# Altium schematic sheet SoM.SchDoc
size A3
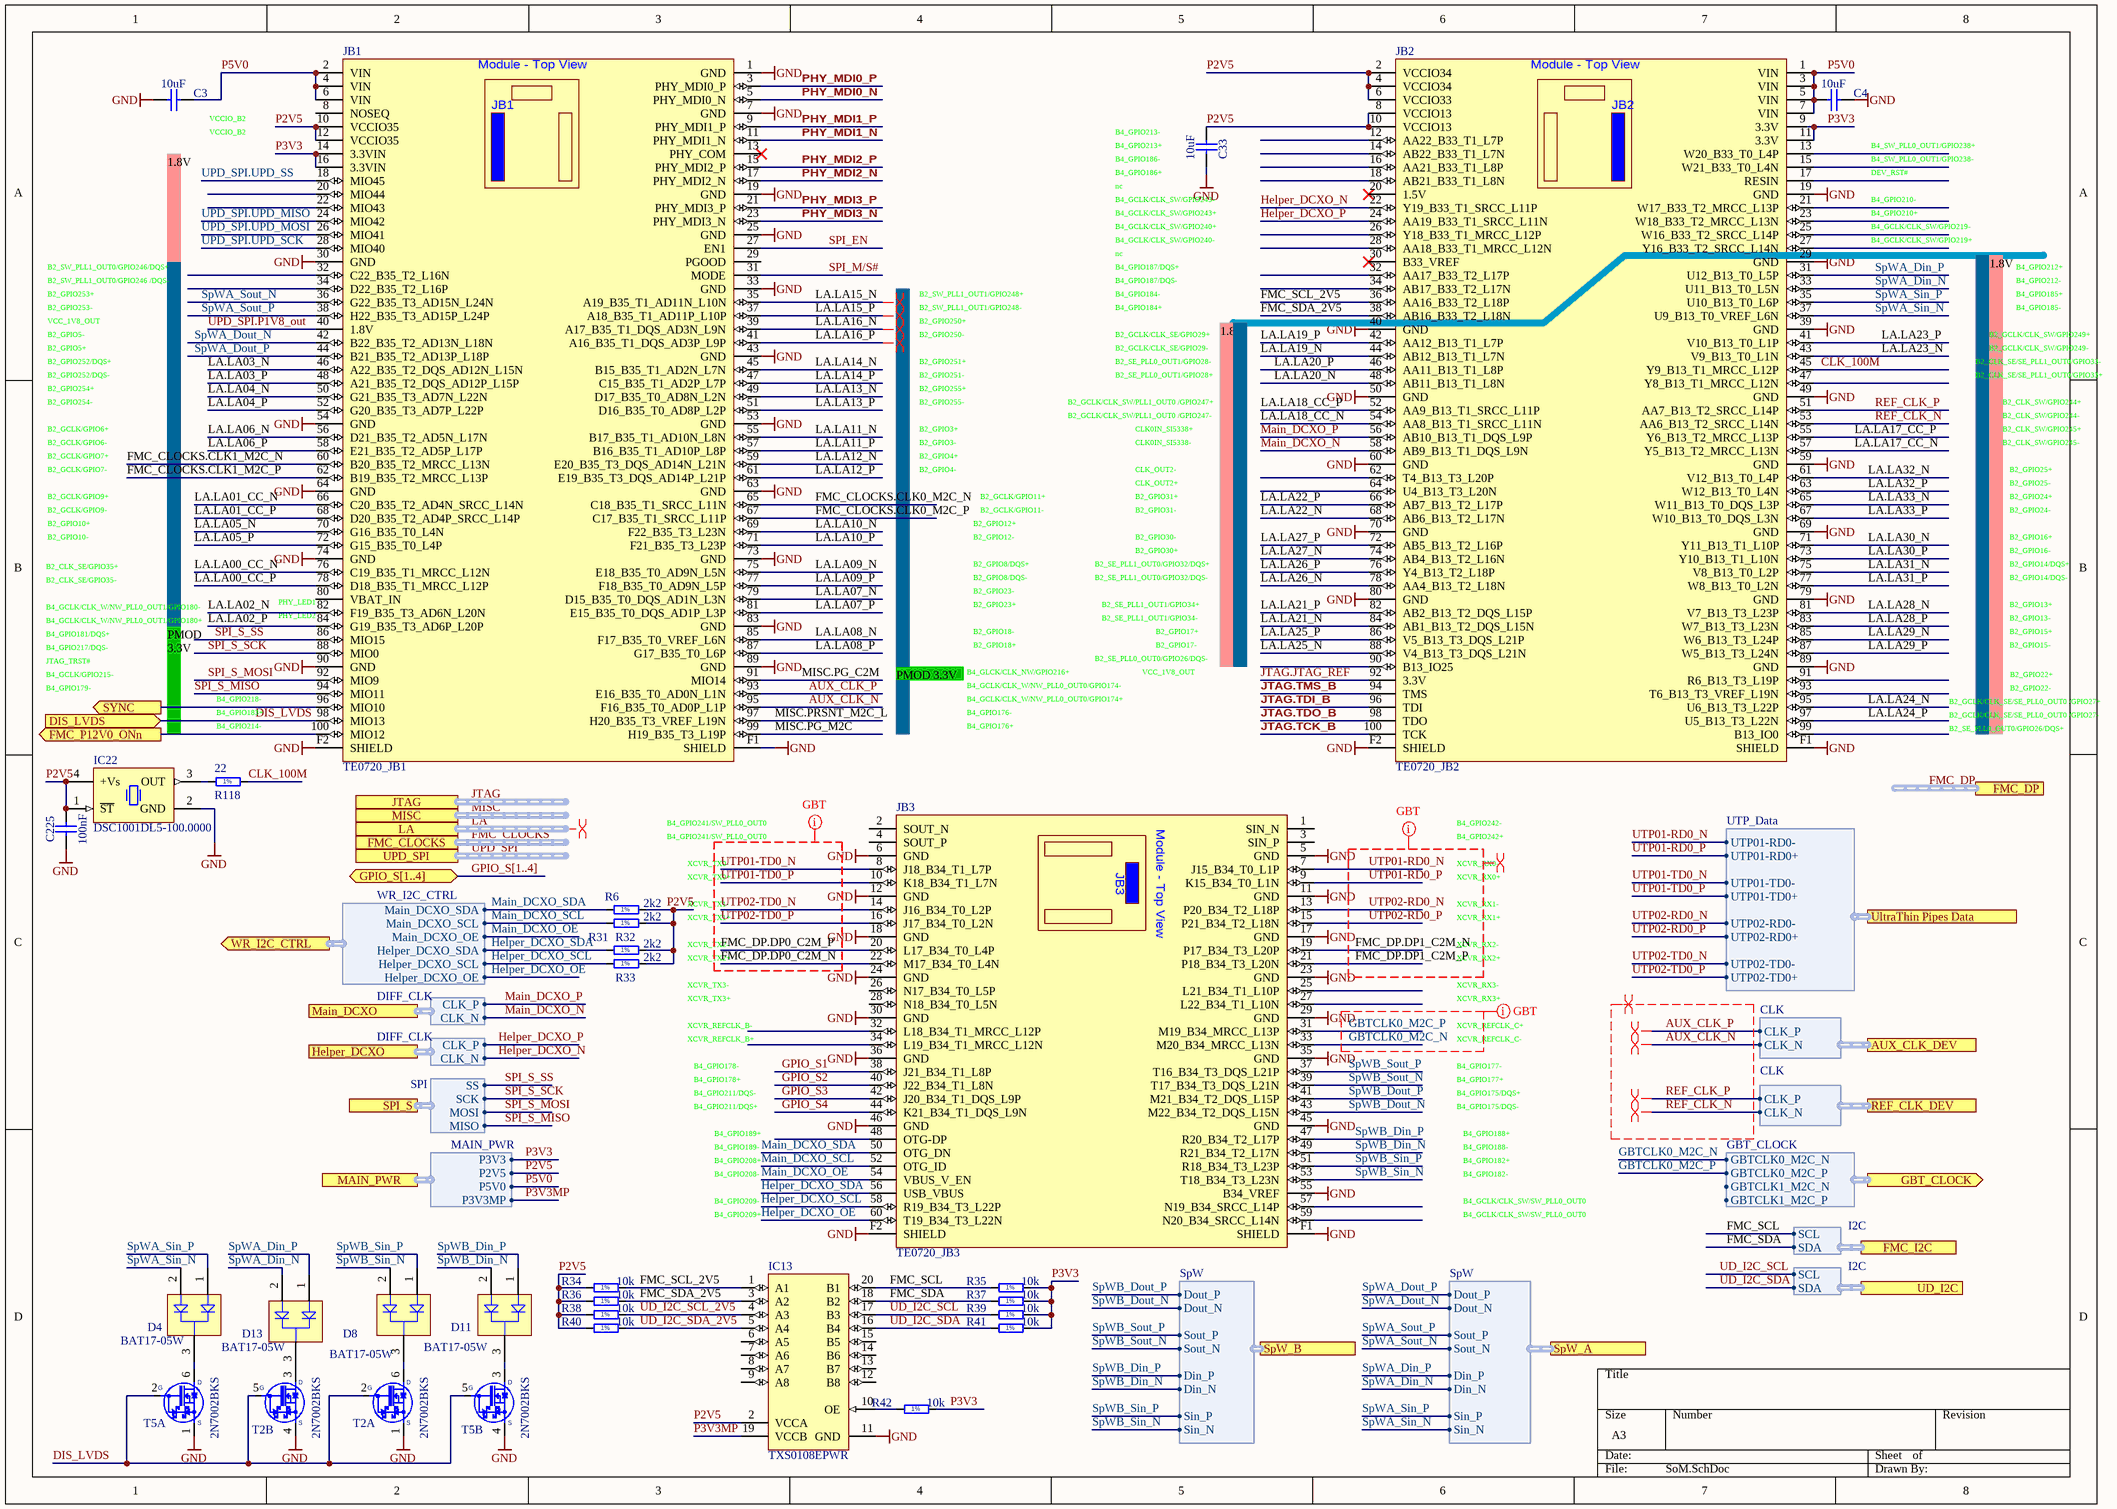
[diagram p0: SoM.SchDoc]

## Parts
C3  10uF  [CAPC2012X95N]
C4  10uF  [CAPC2012X95N]
C33  10uF  [CAPC2012X95N]
C225  100nF  [CAPC0603X33N]
D4  BAT17-05W  [INF-SOT323_N]
D8  BAT17-05W  [INF-SOT323_N]
D11  BAT17-05W  [INF-SOT323_N]
D13  BAT17-05W  [INF-SOT323_N]
IC13  TXS0108EPWR  [PW0020A_M]
IC22  DSC1001DL5-100.0000  [OSC_MICREL_2520]
JB1  TE0720_JB1  [LSHM-150-XXX-X-DV-A-X]
JB2  TE0720_JB2  [LSHM-150-XXX-X-DV-A-X]
JB3  TE0720_JB3  [LSHM-130-04.0-x-DV-A-S-K-TR]
R6  2k2  [RESC1005X40N]
R31  2k2  [RESC1005X40N]
R32  2k2  [RESC1005X40N]
R33  2k2  [RESC1005X40N]
R34  10k  [RESC1005X40N]
R35  10k  [RESC1005X40N]
R36  10k  [RESC1005X40N]
R37  10k  [RESC1005X40N]
R38  10k  [RESC1005X40N]
R39  10k  [RESC1005X40N]
R40  10k  [RESC1005X40N]
R41  10k  [RESC1005X40N]
R42  10k  [RESC1005X40N]
R118  22  [RESC1005X40N]
T2  2N7002BKS  [SOT65P210X110-6N]  (parts A,B of 2)
T5  2N7002BKS  [SOT65P210X110-6N]  (parts A,B of 2)

## Ports
AUX_CLK_DEV (harness CLK), DIS_LVDS (in), FMC_CLOCKS (harness FMC_CLOCKS), FMC_DP (harness FMC_DP), FMC_I2C (harness I2C), FMC_P12V0_ONn (out), GBT_CLOCK (out, harness GBT_CLOCK), GPIO_S[1..4] (bidir), Helper_DCXO (harness DIFF_CLK), JTAG (harness JTAG), LA (harness FMC_J1_LA), Main_DCXO (harness DIFF_CLK), MAIN_PWR (harness MAIN_PWR), MISC (harness MISC), REF_CLK_DEV (harness CLK), SPI_S (harness SPI), SpW_A (harness SpW), SpW_B (harness SpW), SYNC (out), UD_I2C (harness I2C), UltraThin Pipes Data (harness UTP_Data), UPD_SPI (harness UPD_SPI), WR_I2C_CTRL (out, harness WR_I2C_CTRL)

## Harnesses
SpW: Sout_P, Sout_N, Dout_P, Dout_N, Sin_P, Sin_N, Din_P, Din_N
UTP_Data: UTP02-RD0-, UTP02-RD0+, UTP02-TD0-, UTP02-TD0+, UTP01-RD0-, UTP01-RD0+, UTP01-TD0-, UTP01-TD0+
CLK: CLK_P, CLK_N
GBT_CLOCK: GBTCLK0_M2C_N, GBTCLK0_M2C_P, GBTCLK1_M2C_N, GBTCLK1_M2C_P
SPI: MISO, MOSI, SCK, SS
I2C: SCL, SDA
WR_I2C_CTRL: Helper_DCXO_OE, Helper_DCXO_SCL, Helper_DCXO_SDA, Main_DCXO_OE, Main_DCXO_SCL, Main_DCXO_SDA
DIFF_CLK: CLK_N, CLK_P
MAIN_PWR: P3V3, P2V5, P5V0, P3V3MP

## Nets
GND: C3.2 C4.1 C33.2 C225.1 IC13.11(GND) IC22.2(GND) JB1.1(GND) JB1.7(GND) JB1.19(GND) JB1.25(GND) JB1.30(GND) JB1.33(GND) JB1.43(GND) JB1.53(GND) JB1.54(GND) JB1.63(GND) JB1.64(GND) JB1.73(GND) JB1.74(GND) JB1.83(GND) JB1.89(GND) JB1.90(GND) JB1.F1(SHIELD) JB1.F2(SHIELD) JB2.19(GND) JB2.29(GND) JB2.39(GND) JB2.40(GND) JB2.49(GND) JB2.50(GND) JB2.59(GND) JB2.60(GND) JB2.69(GND) JB2.70(GND) JB2.79(GND) JB2.80(GND) JB2.89(GND) JB2.F1(SHIELD) JB2.F2(SHIELD) JB3.5(GND) JB3.6(GND) JB3.11(GND) JB3.12(GND) JB3.17(GND) JB3.18(GND) JB3.23(GND) JB3.24(GND) JB3.29(GND) JB3.30(GND) JB3.35(GND) JB3.36(GND) JB3.45(GND) JB3.46(GND) JB3.55(B34_VREF) JB3.F1(SHIELD) JB3.F2(SHIELD) T2.1(S) T2.4(S) T5.1(S) T5.4(S)
AUX_CLK_N: JB1.95(F16_B35_T0_AD0P_L1P) ; port AUX_CLK_DEV.CLK_N
AUX_CLK_P: JB1.93(E16_B35_T0_AD0N_L1N) ; port AUX_CLK_DEV.CLK_P
CLK_100M: JB2.45(Y9_B13_T1_MRCC_L12P) R118.2
DIS_LVDS: JB1.98(MIO13) T2.2(G) T2.5(G) T5.2(G) T5.5(G) ; port DIS_LVDS
FMC_CLOCKS.CLK0_M2C_N: JB1.65(C18_B35_T1_SRCC_L11N)
FMC_CLOCKS.CLK0_M2C_P: JB1.67(C17_B35_T1_SRCC_L11P)
FMC_CLOCKS.CLK1_M2C_N: JB1.60(B20_B35_T2_MRCC_L13N)
FMC_CLOCKS.CLK1_M2C_P: JB1.62(B19_B35_T2_MRCC_L13P)
FMC_DP.DP0_C2M_N: JB3.22(M17_B34_T0_L4N)
FMC_DP.DP0_C2M_P: JB3.20(L17_B34_T0_L4P)
FMC_DP.DP1_C2M_N: JB3.19(P17_B34_T3_L20P)
FMC_DP.DP1_C2M_P: JB3.21(P18_B34_T3_L20N)
FMC_P12V0_ONn: JB1.100(MIO12) ; port FMC_P12V0_ONn
FMC_SCL: IC13.20(B1) R35.1 ; port FMC_I2C.SCL
FMC_SCL_2V5: IC13.1(A1) JB2.36(AA16_B33_T2_L18P) R34.2
FMC_SDA: IC13.18(B2) R37.1 ; port FMC_I2C.SDA
FMC_SDA_2V5: IC13.3(A2) JB2.38(AB16_B33_T2_L18N) R36.2
GBTCLK0_M2C_N: JB3.33(M20_B34_MRCC_L13N) ; port GBT_CLOCK.GBTCLK0_M2C_N
GBTCLK0_M2C_P: JB3.31(M19_B34_MRCC_L13P) ; port GBT_CLOCK.GBTCLK0_M2C_P
GPIO_S1: JB3.38(J21_B34_T1_L8P)
GPIO_S2: JB3.40(J22_B34_T1_L8N)
GPIO_S3: JB3.42(J20_B34_T1_DQS_L9P)
GPIO_S4: JB3.44(K21_B34_T1_DQS_L9N)
Helper_DCXO_N: JB2.22(Y19_B33_T1_SRCC_L11P) ; port Helper_DCXO.CLK_N
Helper_DCXO_OE: JB3.60(T19_B34_T3_L22N) ; port WR_I2C_CTRL.Helper_DCXO_OE
Helper_DCXO_P: JB2.24(AA19_B33_T1_SRCC_L11N) ; port Helper_DCXO.CLK_P
Helper_DCXO_SCL: JB3.58(R19_B34_T3_L22P) R33.1 ; port WR_I2C_CTRL.Helper_DCXO_SCL
Helper_DCXO_SDA: JB3.56(USB_VBUS) R31.1 ; port WR_I2C_CTRL.Helper_DCXO_SDA
JTAG.JTAG_REF: JB2.92(3.3V)
JTAG.TCK_B: JB2.100(TCK)
JTAG.TDI_B: JB2.96(TDI)
JTAG.TDO_B: JB2.98(TDO)
JTAG.TMS_B: JB2.94(TMS)
LA.LA00_CC_N: JB1.76(C19_B35_T1_MRCC_L12N)
LA.LA00_CC_P: JB1.78(D18_B35_T1_MRCC_L12P)
LA.LA01_CC_N: JB1.66(C20_B35_T2_AD4N_SRCC_L14N)
LA.LA01_CC_P: JB1.68(D20_B35_T2_AD4P_SRCC_L14P)
LA.LA02_N: JB1.82(F19_B35_T3_AD6N_L20N)
LA.LA02_P: JB1.84(G19_B35_T3_AD6P_L20P)
LA.LA03_N: JB1.46(A22_B35_T2_DQS_AD12N_L15N)
LA.LA03_P: JB1.48(A21_B35_T2_DQS_AD12P_L15P)
LA.LA04_N: JB1.50(G21_B35_T3_AD7N_L22N)
LA.LA04_P: JB1.52(G20_B35_T3_AD7P_L22P)
LA.LA05_N: JB1.70(G16_B35_T0_L4N)
LA.LA05_P: JB1.72(G15_B35_T0_L4P)
LA.LA06_N: JB1.56(D21_B35_T2_AD5N_L17N)
LA.LA06_P: JB1.58(E21_B35_T2_AD5P_L17P)
LA.LA07_N: JB1.79(D15_B35_T0_DQS_AD1N_L3N)
LA.LA07_P: JB1.81(E15_B35_T0_DQS_AD1P_L3P)
LA.LA08_N: JB1.85(F17_B35_T0_VREF_L6N)
LA.LA08_P: JB1.87(G17_B35_T0_L6P)
LA.LA09_N: JB1.75(E18_B35_T0_AD9N_L5N)
LA.LA09_P: JB1.77(F18_B35_T0_AD9N_L5P)
LA.LA10_N: JB1.69(F22_B35_T3_L23N)
LA.LA10_P: JB1.71(F21_B35_T3_L23P)
LA.LA11_N: JB1.55(B17_B35_T1_AD10N_L8N)
LA.LA11_P: JB1.57(B16_B35_T1_AD10P_L8P)
LA.LA12_N: JB1.59(E20_B35_T3_DQS_AD14N_L21N)
LA.LA12_P: JB1.61(E19_B35_T3_DQS_AD14P_L21P)
LA.LA13_N: JB1.49(D17_B35_T0_AD8N_L2N)
LA.LA13_P: JB1.51(D16_B35_T0_AD8P_L2P)
LA.LA14_N: JB1.45(B15_B35_T1_AD2N_L7N)
LA.LA14_P: JB1.47(C15_B35_T1_AD2P_L7P)
LA.LA15_N: JB1.35(A19_B35_T1_AD11N_L10N)
LA.LA15_P: JB1.37(A18_B35_T1_AD11P_L10P)
LA.LA16_N: JB1.39(A17_B35_T1_DQS_AD3N_L9N)
LA.LA16_P: JB1.41(A16_B35_T1_DQS_AD3P_L9P)
LA.LA17_CC_N: JB2.57(Y5_B13_T2_MRCC_L13N)
LA.LA17_CC_P: JB2.55(Y6_B13_T2_MRCC_L13P)
LA.LA18_CC_N: JB2.54(AA8_B13_T1_SRCC_L11N)
LA.LA18_CC_P: JB2.52(AA9_B13_T1_SRCC_L11P)
LA.LA19_N: JB2.44(AB12_B13_T1_L7N)
LA.LA19_P: JB2.42(AA12_B13_T1_L7P)
LA.LA20_N: JB2.48(AB11_B13_T1_L8N)
LA.LA20_P: JB2.46(AA11_B13_T1_L8P)
LA.LA21_N: JB2.84(AB1_B13_T2_DQS_L15N)
LA.LA21_P: JB2.82(AB2_B13_T2_DQS_L15P)
LA.LA22_N: JB2.68(AB6_B13_T2_L17N)
LA.LA22_P: JB2.66(AB7_B13_T2_L17P)
LA.LA23_N: JB2.43(V9_B13_T0_L1N)
LA.LA23_P: JB2.41(V10_B13_T0_L1P)
LA.LA24_N: JB2.95(U6_B13_T3_L22P)
LA.LA24_P: JB2.97(U5_B13_T3_L22N)
LA.LA25_N: JB2.88(V4_B13_T3_DQS_L21N)
LA.LA25_P: JB2.86(V5_B13_T3_DQS_L21P)
LA.LA26_N: JB2.78(AA4_B13_T2_L18N)
LA.LA26_P: JB2.76(Y4_B13_T2_L18P)
LA.LA27_N: JB2.74(AB4_B13_T2_L16N)
LA.LA27_P: JB2.72(AB5_B13_T2_L16P)
LA.LA28_N: JB2.81(V7_B13_T3_L23P)
LA.LA28_P: JB2.83(W7_B13_T3_L23N)
LA.LA29_N: JB2.85(W6_B13_T3_L24P)
LA.LA29_P: JB2.87(W5_B13_T3_L24N)
LA.LA30_N: JB2.71(Y11_B13_T1_L10P)
LA.LA30_P: JB2.73(Y10_B13_T1_L10N)
LA.LA31_N: JB2.75(V8_B13_T0_L2P)
LA.LA31_P: JB2.77(W8_B13_T0_L2N)
LA.LA32_N: JB2.61(V12_B13_T0_L4P)
LA.LA32_P: JB2.63(W12_B13_T0_L4N)
LA.LA33_N: JB2.65(W11_B13_T0_DQS_L3P)
LA.LA33_P: JB2.67(W10_B13_T0_DQS_L3N)
Main_DCXO_N: JB2.58(AB9_B13_T1_DQS_L9N) ; port Main_DCXO.CLK_N
Main_DCXO_OE: JB3.54(VBUS_V_EN) ; port WR_I2C_CTRL.Main_DCXO_OE
Main_DCXO_P: JB2.56(AB10_B13_T1_DQS_L9P) ; port Main_DCXO.CLK_P
Main_DCXO_SCL: JB3.52(OTG_ID) R32.1 ; port WR_I2C_CTRL.Main_DCXO_SCL
Main_DCXO_SDA: JB3.50(OTG_DN) R6.1 ; port WR_I2C_CTRL.Main_DCXO_SDA
MISC.PG_C2M: JB1.91(MIO14)
MISC.PG_M2C: JB1.99(H19_B35_T3_L19P)
MISC.PRSNT_M2C_L: JB1.97(H20_B35_T3_VREF_L19N)
P2V5: C33.1 C225.2 IC13.2(VCCA) IC22.1(~{ST}) IC22.4(+Vs) JB1.10(VCCIO35) JB1.12(VCCIO35) JB2.2(VCCIO34) JB2.4(VCCIO34) JB2.6(VCCIO33) JB2.8(VCCIO13) JB2.10(VCCIO13) R6.2 R31.2 R32.2 R33.2 R34.1 R36.1 R38.1 R40.1 ; port MAIN_PWR.P2V5  [also labelled XCVR_TX1-]
P3V3: JB1.14(3.3VIN) JB1.16(3.3VIN) JB2.9(3.3V) JB2.11(3.3V) R35.2 R37.2 R39.2 R41.2 R42.2 ; port MAIN_PWR.P3V3
P3V3MP: IC13.19(VCCB) ; port MAIN_PWR.P3V3MP
P5V0: C3.1 C4.2 JB1.2(VIN) JB1.4(VIN) JB1.6(VIN) JB2.1(VIN) JB2.3(VIN) JB2.5(VIN) JB2.7(VIN) ; port MAIN_PWR.P5V0
PHY_MDI0_N: JB1.5(PHY_MDI0_N)
PHY_MDI0_P: JB1.3(PHY_MDI0_P)
PHY_MDI1_N: JB1.11(PHY_MDI1_N)
PHY_MDI1_P: JB1.9(PHY_MDI1_P)
PHY_MDI2_N: JB1.17(PHY_MDI2_N)
PHY_MDI2_P: JB1.15(PHY_MDI2_P)
PHY_MDI3_N: JB1.23(PHY_MDI3_N)
PHY_MDI3_P: JB1.21(PHY_MDI3_P)
REF_CLK_N: JB2.53(AA6_B13_T2_SRCC_L14N) ; port REF_CLK_DEV.CLK_N
REF_CLK_P: JB2.51(AA7_B13_T2_SRCC_L14P) ; port REF_CLK_DEV.CLK_P
SPI_EN: JB1.27(EN1)
SPI_M/S#: JB1.31(MODE)
SPI_S_MISO: JB1.94(MIO11) ; port SPI_S.MISO
SPI_S_MOSI: JB1.92(MIO9) ; port SPI_S.MOSI
SPI_S_SCK: JB1.88(MIO0) ; port SPI_S.SCK
SPI_S_SS: JB1.86(MIO15) ; port SPI_S.SS
SpWA_Din_N: D13.2(A2) JB2.33(U11_B13_T0_L5N) ; port SpW_A.Din_N
SpWA_Din_P: D13.1(A1) JB2.31(U12_B13_T0_L5P) ; port SpW_A.Din_P
SpWA_Dout_N: JB1.42(B22_B35_T2_AD13N_L18N) ; port SpW_A.Dout_N
SpWA_Dout_P: JB1.44(B21_B35_T2_AD13P_L18P) ; port SpW_A.Dout_P
SpWA_Sin_N: D4.2(A2) JB2.37(U9_B13_T0_VREF_L6N) ; port SpW_A.Sin_N
SpWA_Sin_P: D4.1(A1) JB2.35(U10_B13_T0_L6P) ; port SpW_A.Sin_P
SpWA_Sout_N: JB1.36(G22_B35_T3_AD15N_L24N) ; port SpW_A.Sout_N
SpWA_Sout_P: JB1.38(H22_B35_T3_AD15P_L24P) ; port SpW_A.Sout_P
SpWB_Din_N: D11.2(A2) JB3.49(R21_B34_T2_L17N) ; port SpW_B.Din_N
SpWB_Din_P: D11.1(A1) JB3.47(R20_B34_T2_L17P) ; port SpW_B.Din_P
SpWB_Dout_N: JB3.43(M22_B34_T2_DQS_L15N) ; port SpW_B.Dout_N
SpWB_Dout_P: JB3.41(M21_B34_T2_DQS_L15P) ; port SpW_B.Dout_P
SpWB_Sin_N: D8.2(A2) JB3.53(T18_B34_T3_L23N) ; port SpW_B.Sin_N
SpWB_Sin_P: D8.1(A1) JB3.51(R18_B34_T3_L23P) ; port SpW_B.Sin_P
SpWB_Sout_N: JB3.39(T17_B34_T3_DQS_L21N) ; port SpW_B.Sout_N
SpWB_Sout_P: JB3.37(T16_B34_T3_DQS_L21P) ; port SpW_B.Sout_P
SYNC: JB1.96(MIO10) ; port SYNC
UD_I2C_SCL: IC13.17(B3) R39.1 ; port UD_I2C.SCL
UD_I2C_SCL_2V5: IC13.4(A3) R38.2
UD_I2C_SDA: IC13.16(B4) R41.1 ; port UD_I2C.SDA
UD_I2C_SDA_2V5: IC13.5(A4) R40.2
UPD_SPI.P1V8_out: JB1.40(1.8V)
UPD_SPI.UPD_MISO: JB1.24(MIO42)
UPD_SPI.UPD_MOSI: JB1.26(MIO41)
UPD_SPI.UPD_SCK: JB1.28(MIO40)
UPD_SPI.UPD_SS: JB1.18(MIO45)
UTP01-RD0_N: JB3.7(J15_B34_T0_L1P) ; port UltraThin Pipes Data.UTP01-RD0-
UTP01-RD0_P: JB3.9(K15_B34_T0_L1N) ; port UltraThin Pipes Data.UTP01-RD0+
UTP01-TD0_N: JB3.8(J18_B34_T1_L7P) ; port UltraThin Pipes Data.UTP01-TD0-
UTP01-TD0_P: JB3.10(K18_B34_T1_L7N) ; port UltraThin Pipes Data.UTP01-TD0+
UTP02-RD0_N: JB3.13(P20_B34_T2_L18P) ; port UltraThin Pipes Data.UTP02-RD0-
UTP02-RD0_P: JB3.15(P21_B34_T2_L18N) ; port UltraThin Pipes Data.UTP02-RD0+
UTP02-TD0_N: JB3.14(J16_B34_T0_L2P) ; port UltraThin Pipes Data.UTP02-TD0-
UTP02-TD0_P: JB3.16(J17_B34_T0_L2N) ; port UltraThin Pipes Data.UTP02-TD0+
NetD4_3: D4.3(K) T5.6(D)
NetD8_3: D8.3(K) T2.6(D)
NetD11_3: D11.3(K) T5.3(D)
NetD13_3: D13.3(K) T2.3(D)
NetIC13_10: IC13.10(OE) R42.1
NetIC22_3: IC22.3(OUT) R118.1

Not connected (* = marked no-connect by the designer): IC13 6(A5) 7(A6) 8(A7) 9(A8) 12(B8) 13(B7) 14(B6) 15(B5); JB1 8(NOSEQ) 13(PHY_COM)* 20(MIO44) 22(MIO43) 29(PGOOD) 32(C22_B35_T2_L16N) 34(D22_B35_T2_L16P) 80(VBAT_IN); JB2 12(AA22_B33_T1_L7P) 13(W20_B33_T0_L4P) 14(AB22_B33_T1_L7N) 15(W21_B33_T0_L4N) 16(AA21_B33_T1_L8P) 17(RESIN) 18(AB21_B33_T1_L8N) 20(1.5V)* 21(W17_B33_T2_MRCC_L13P) 23(W18_B33_T2_MRCC_L13N) 25(W16_B33_T2_SRCC_L14P) 26(Y18_B33_T1_MRCC_L12P) 27(Y16_B33_T2_SRCC_L14N) 28(AA18_B33_T1_MRCC_L12N) 30(B33_VREF)* 32(AA17_B33_T2_L17P) 34(AB17_B33_T2_L17N) 47(Y8_B13_T1_MRCC_L12N) 62(T4_B13_T3_L20P) 64(U4_B13_T3_L20N) 90(B13_IO25) 91(R6_B13_T3_L19P) 93(T6_B13_T3_VREF_L19N) 99(B13_IO0); JB3 1(SIN_N) 2(SOUT_N) 3(SIN_P) 4(SOUT_P) 25(L21_B34_T1_L10P) 26(N17_B34_T0_L5P) 27(L22_B34_T1_L10N) 28(N18_B34_T0_L5N) 32(L18_B34_T1_MRCC_L12P) 34(L19_B34_T1_MRCC_L12N) 48(OTG-DP) 57(N19_B34_SRCC_L14P) 59(N20_B34_SRCC_L14N)

## Buses and harness runs
bus GPIO_S[1..4] = port GPIO_S[1..4]
harness FMC_CLOCKS = port FMC_CLOCKS
harness FMC_DP = port FMC_DP
harness JTAG = port JTAG
harness LA = port LA
harness MISC = port MISC
harness UPD_SPI = port UPD_SPI

## Layout directives
differential pair: (no net found under the mark), AUX_CLK_N, AUX_CLK_P, FMC_DP.DP1_C2M_N, FMC_DP.DP1_C2M_P, LA.LA15_N, LA.LA15_P, LA.LA16_N, LA.LA16_P, REF_CLK_N, REF_CLK_P, UTP01-RD0_N, UTP01-RD0_P, UTP02-RD0_N, UTP02-RD0_P, XCVR_RX0+, XCVR_RX0-, XCVR_RX1+, XCVR_RX1-, XCVR_RX2+, XCVR_RX2-
net class GBT; rule Differential Pairs Routing [Pref Gap = 4.33mil    Min Gap  = 4.291mil    Max Gap  = 5milPref Width = 3.385mil    Min Width  = 3.385mil    Max Width  = 7.086mil]: FMC_DP.DP0_C2M_N, FMC_DP.DP0_C2M_P, FMC_DP.DP1_C2M_N, FMC_DP.DP1_C2M_P, GBTCLK0_M2C_N, GBTCLK0_M2C_P, UTP01-RD0_N, UTP01-RD0_P, UTP01-TD0_N, UTP01-TD0_P, UTP02-RD0_N, UTP02-RD0_P, UTP02-TD0_N, UTP02-TD0_P, XCVR_REFCLK_C+, XCVR_REFCLK_C-, XCVR_RX0+, XCVR_RX0-, XCVR_RX1+, XCVR_RX1-, XCVR_RX2+, XCVR_RX2-

## Notes on the sheet
- (near C3) VCCIO_B2
- (near C33) B4_GPIO213-
- (near C33) B4_GPIO213+
- (near C33) B4_GPIO186-
- B4_GPIO186+
- (near C4) B4_SW_PLL0_OUT1/GPIO238+
- B4_SW_PLL0_OUT1/GPIO238-
- DEV_RST#
- nc
- (near C33) B4_GCLK/CLK_SW/GPIO243-
- B4_GCLK/CLK_SW/GPIO243+
- B4_GCLK/CLK_SW/GPIO240+
- B4_GCLK/CLK_SW/GPIO240-
- B4_GPIO210-
- B4_GPIO210+
- B4_GCLK/CLK_SW/GPIO219-
- B4_GCLK/CLK_SW/GPIO219+
- B2_SW_PLL1_OUT0/GPIO246/DQS+
- B2_SW_PLL1_OUT0/GPIO246 /DQS-
- B2_GPIO253+
- B2_GPIO253-
- 1.8V
- B2_SW_PLL1_OUT1/GPIO248+
- B2_SW_PLL1_OUT1/GPIO248-
- B4_GPIO187/DQS+
- B4_GPIO187/DQS-
- B4_GPIO184-
- B4_GPIO184+
- B4_GPIO212+
- B4_GPIO212-
- B4_GPIO185+
- B4_GPIO185-
- VCC_1V8_OUT
- B2_GPIO5-
- B2_GPIO5+
- B2_GPIO252/DQS+
- B2_GPIO252/DQS-
- B2_GPIO250+
- B2_GPIO250-
- B2_GPIO251+
- B2_GPIO251-
- B2_GCLK/CLK_SE/GPIO29+
- B2_GCLK/CLK_SE/GPIO29-
- B2_SE_PLL0_OUT1/GPIO28-
- B2_SE_PLL0_OUT1/GPIO28+
- B2_CLK_SE/SE_PLL1_OUT0/GPIO33-
- B2_CLK_SE/SE_PLL1_OUT0/GPIO33+
- B2_GCLK/CLK_SW/GPIO249+
- B2_GCLK/CLK_SW/GPIO249-
- B2_GPIO254+
- B2_GPIO254-
- B2_GCLK/GPIO6+
- B2_GCLK/GPIO6-
- B2_GPIO255+
- B2_GPIO255-
- B2_GPIO3+
- B2_GPIO3-
- B2_GCLK/CLK_SW/PLL1_OUT0	/GPIO247+
- B2_GCLK/CLK_SW/PLL1_OUT0	/GPIO247-
- CLK0IN_SI5338+
- CLK0IN_SI5338-
- B2_CLK_SW/GPIO244+
- B2_CLK_SW/GPIO244-
- B2_CLK_SW/GPIO245+
- B2_CLK_SW/GPIO245-
- B2_GCLK/GPIO7+
- B2_GCLK/GPIO7-
- B2_GCLK/GPIO9+
- B2_GCLK/GPIO9-
- B2_GPIO4+
- B2_GPIO4-
- B2_GCLK/GPIO11+
- B2_GCLK/GPIO11-
- CLK_OUT2-
- CLK_OUT2+
- B2_GPIO31+
- B2_GPIO31-
- B2_GPIO25+
- B2_GPIO25-
- B2_GPIO24+
- B2_GPIO24-
- B2_CLK_SE/GPIO35+
- B2_CLK_SE/GPIO35-
- B2_GPIO10+
- B2_GPIO10-
- B2_GPIO12+
- B2_GPIO12-
- B2_GPIO8/DQS+
- B2_GPIO8/DQS-
- B2_SE_PLL1_OUT0/GPIO32/DQS+
- B2_SE_PLL1_OUT0/GPIO32/DQS-
- B2_GPIO30-
- B2_GPIO30+
- B2_GPIO16+
- B2_GPIO16-
- B2_GPIO14/DQS+
- B2_GPIO14/DQS-
- B4_GCLK/CLK_W/NW_PLL0_OUT1/GPIO180-
- B4_GCLK/CLK_W/NW_PLL0_OUT1/GPIO180+
- B4_GPIO181/DQS+
- B4_GPIO217/DQS-
- (near JB1) PHY_LED1
- (near JB1) PHY_LED2
- B2_GPIO23-
- B2_GPIO23+
- B2_GPIO18-
- B2_GPIO18+
- B2_SE_PLL1_OUT1/GPIO34+
- B2_SE_PLL1_OUT1/GPIO34-
- B2_GPIO17+
- B2_GPIO17-
- B2_GPIO13+
- B2_GPIO13-
- B2_GPIO15+
- B2_GPIO15-
- JTAG_TRST#
- B4_GCLK/GPIO215-
- B4_GPIO179-
- B4_GPIO218-
- B4_GPIO183+
- PMOD 3.3V
- B4_GLCK/CLK_NW/GPIO216+
- B4_GCLK/CLK_W/NW_PLL0_OUT0/GPIO174-
- B4_GCLK/CLK_W/NW_PLL0_OUT0/GPIO174+
- B4_GPIO176-
- B2_SE_PLL0_OUT0/GPIO26/DQS-
- B2_GCLK/CLK_SE/SE_PLL0_OUT0	/GPIO27+
- B2_GCLK/CLK_SE/SE_PLL0_OUT0	/GPIO27-
- B2_GPIO22+
- B2_GPIO22-
- B4_GPIO214-
- B4_GPIO176+
- B2_SE_PLL0_OUT0/GPIO26/DQS+
- B4_GCLK/CLK_SW/SW_PLL0_OUT0
- Labels drawn without touching a wire or pin: B4_GCLK/CLK_SW/SW_PLL0_OUT0, B4_GPIO175/DQS+, B4_GPIO175/DQS-, B4_GPIO177+, B4_GPIO177-, B4_GPIO178+, B4_GPIO178-, B4_GPIO182+, B4_GPIO182-, B4_GPIO188+, B4_GPIO188-, B4_GPIO189+, B4_GPIO189-, B4_GPIO208+, B4_GPIO208-, B4_GPIO209+, B4_GPIO209-, B4_GPIO211/DQS+, B4_GPIO211/DQS-, B4_GPIO241/SW_PLL0_OUT0, B4_GPIO242+, B4_GPIO242-, XCVR_REFCLK_B+, XCVR_REFCLK_B-, XCVR_REFCLK_C+, XCVR_REFCLK_C-, XCVR_RX0+, XCVR_RX0-, XCVR_RX1+, XCVR_RX1-, XCVR_RX2+, XCVR_RX2-, XCVR_RX3+, XCVR_RX3-, XCVR_TX0+, XCVR_TX0-, XCVR_TX1+, XCVR_TX2+, XCVR_TX2-, XCVR_TX3+, XCVR_TX3-
- (in symbol 25285) Module - Top View
- (in symbol 25286) Module - Top View
- (in symbol 25287) Module - Top View
- (in symbol R0402_2K2_1%_0.0625W_100PPM) 1%
- (in symbol R0402_10k_1%_0.0625W_100PPM) 1%
- (in symbol R0402_22R_1%_0.0625W_100PPM) 1%

## Library data of the parts
C3 C4 C33 = CC0805_10UF_25V_10%_X5R: Non-polarised capacitor; Part Description: SMD Multilayer Chip Ceramic Capacitor; Manufacturer: GENERIC; Manufacturer1 Part Number: GRM219R61E106KA12D; Voltage: 25V; TC: X5R; Tolerance: ±10%; Part Number: CC0805_10UF_25V_10%_X5R; Component Kind: Standard; Component Type: Standard; Pin Count: 2; Value: 10uF; Status: Preferred; Manufacturer Part Number: CC0805_10UF_25V_10%_X5R; Case: 0805; Mounted: Yes; Socket: No; SMD: Yes; Sense: No; Manufacturer1 Example: MURATA; Manufacturer1 ComponentHeight: 0.95mm; HelpURL: \\cern.ch\dfs\Applications\Altium\Datasheets\CC0805_X5R_MURATA_GRM.pdf; Author: CERN DEM JLC; CreateDate: 25/10/2012; LatestRevisionDate: 06/09/2016
C225 = CC0201_100NF_6.3V_10%_X5R: Non-polarised capacitor; Manufacturer: GENERIC; Part Description: SMD Multilayer Chip Ceramic Capacitor; Manufacturer1 Part Number: 02016D104KAT2A; Voltage: 6.3V; TC: X5R; Tolerance: ±10%; Part Number: CC0201_100NF_6.3V_10%_X5R; Component Kind: Standard; Component Type: Standard; Pin Count: 2; Value: 100nF; Status: Not Recommended; Manufacturer Part Number: CC0201_100NF_6.3V_10%_X5R; Case: 0201; Mounted: Yes; Socket: No; SMD: Yes; Sense: No; Manufacturer1 Example: AVX; Manufacturer1 ComponentHeight: 0.33mm; HelpURL: \\cern.ch\dfs\Applications\Altium\Datasheets\CC0201_X5R_AVX.pdf; Author: CERN DEM JLC; CreateDate: 03/12/2007; LatestRevisionDate: 03/12/2007
D4 D8 D11 D13 = CMP-1154-00018-1: Dual Silicon Schottky Diode, 130 mA IF Max, SOT323, Green; Manufacturer: Infineon; VF (typ): 0.34 V; CT (typ): 0.55 pF; Green: yes; Group: RF Mixer; IF (max): 130 mA; VR (max): 4 V; ComponentLink1URL: http://www.infineon.com/; Mounting Technology: Surface Mount; Halogen-free: yes; DatasheetVersion: Jun-2011; ComponentLink3Description: Package Specification; ComponentLink2URL: http://www.infineon.com/dgdl/bat17series.pdf?folderId=db3a304314dca3890114ff6812070b44&fileId=db3a304314dca389011517d785d60d4e&location=en.Products.RF.RF_Mixer___Detector_Schottky_Diodes.DATASHEET.bat17series.pdf; PartNumber: BAT17-05W; ComponentLink3URL: http://www.infineon.com/dgdl/SOT323-Package_Overview.pdf?folderId=db3a30431936bc4b0119533e1dcb3c92&fileId=db3a30431936bc4b011953495f283cb1; Configuration: Dual; PackageDescription: 3-Pin Small Outline Transistor Package, 1.25 x 2 mm Body, 0.65 mm Pitch; ComponentLink1Description: Manufacturer URL; ComponentLink2Description: Datasheet; PackageReference: SOT323
IC13 = CMP-2000-04956-1: Bidirectional Voltage-Level Translator for Open-Drain and Push-Pull Application, 8 bit, 1.2 to 3.6 V, -40 to 85 degC, 20-Pin TSSOP, Green (RoHS & no Sb/Br), Tape and Reel; Manufacturer: Texas Instruments; Logic Type: VoltageLevelTranslator; Output Current: 620µA; Propagation Delay: 4.8ns; Supply Voltage Min: 1.2V; No. of Inputs: 8; Supply Voltage Max: 5.5V; SVHC: NoSVHC(16-Jun-2014); No. of Pins: 20; Datasheet URL: https://datasheet.ciiva.com/14287/txs0108e-14287280.pdf; Operating Temperature Min: -40degC; Logic Case Style: TSSOP; Packaging: CutTape; Datasheet Version: Rev. B, 09/2008; MSL: MSL1-Unlimited; Manufacturer URL: http://www.ti.com/; Operating Temperature Max: 85degC
IC22 = OSC_DSC1001DL5-100.0000: MEMS 100MHz oscillator; Manufacturer: Micrel; Part Description: MEMS Oscillator 100MHz; Bonding: No; PressFit: No; Case: *; Component Kind: Standard; Component Type: Standard; ComponentHeigth: *; CreateDate: 2018-01-01; Device: DSC1001DL5-100.0000; Footprint: *; HelpURL: *; LatestRevisionDate: 2018-01-01; Manufacturer Part Number: DSC1001DL5-100.0000; Mounted: Yes; PackageDescription: MICREL SMD Oscillator, QFN, 4 pins, 2.5mm x 2.0mm; Part Number: DSC1001DL5-100.0000; Pin Count: 4; Sense: No; SMD: Yes; Socket: No; Value: *
JB1 = 25285: TE0720-JB1; AN: 25285; Mixed: SMT; Trenz-Stock: Yes; Trenz-Article-Number: 23838
JB2 = 25286: TE0720-JB2; AN: 25286; Mixed: SMT; Trenz-Stock: Yes; Trenz-Article-Number: 23838
JB3 = 25287: TE0720-JB3; AN: 25287; Mixed: SMT; Trenz-Stock: Yes; Trenz-Article-Number: 24903
R6 R31-R33 = R0402_2K2_1%_0.0625W_100PPM: Resistor - 1%; Part Description: General Purpose Thick Film Chip Resistor; Manufacturer: GENERIC; Manufacturer1 Part Number: 232270672202L; TC: ±100ppm/°C; PressFit: No; Part Number: R0402_2K2_1%_0.0625W_100PPM; Component Kind: Standard; Component Type: Standard; Pin Count: 2; Value: 2k2; Status: Not Recommended; Power: 0.0625W; Tolerance: ±1%; Manufacturer Part Number: R0402_2K2_1%_0.0625W_100PPM; Case: 0402; Mounted: Yes; Sense: No; Socket: No; SMD: Yes; Manufacturer1 Example: YAGEO PHYCOMP; Manufacturer1 ComponentHeight: 0.4mm; HelpURL: \\cern.ch\dfs\Applications\Altium\Datasheets\R0402_Phycomp_RC0402.pdf; Author: CERN DEM JLC; CreateDate: 03.12.2007; LatestRevisionDate: 17.10.2012
R34-R42 = R0402_10k_1%_0.0625W_100PPM: Resistor - 1%; Part Description: General Purpose Thick Film Chip Resistor; Manufacturer: GENERIC; Manufacturer1 Part Number: 232270671003L; TC: ±100ppm/°C; PressFit: No; Part Number: R0402_10K_1%_0.0625W_100PPM; Component Kind: Standard; Component Type: Standard; Pin Count: 2; Value: 10k; Status: Not Recommended; Power: 0.0625W; Tolerance: ±1%; Manufacturer Part Number: R0402_10K_1%_0.0625W_100PPM; Case: 0402; Mounted: Yes; Sense: No; Socket: No; SMD: Yes; Manufacturer1 Example: YAGEO PHYCOMP; Manufacturer1 ComponentHeight: 0.4mm; HelpURL: \\cern.ch\dfs\Applications\Altium\Datasheets\R0402_Phycomp_RC0402.pdf; Author: CERN DEM JLC; CreateDate: 03.12.2007; LatestRevisionDate: 17.10.2012
R118 = R0402_22R_1%_0.0625W_100PPM: Resistor - 1%; Part Description: General Purpose Thick Film Chip Resistor; Manufacturer: GENERIC; Manufacturer1 Part Number: 232270672209L; TC: ±100ppm/°C; PressFit: No; Part Number: R0402_22R_1%_0.0625W_100PPM; Component Kind: Standard; Component Type: Standard; Pin Count: 2; Value: 22; Status: Not Recommended; Power: 0.0625W; Tolerance: ±1%; Manufacturer Part Number: R0402_22R_1%_0.0625W_100PPM; Case: 0402; Mounted: Yes; Sense: No; Socket: No; SMD: Yes; Manufacturer1 Example: YAGEO PHYCOMP; Manufacturer1 ComponentHeight: 0.4mm; HelpURL: \\cern.ch\dfs\Applications\Altium\Datasheets\R0402_Phycomp_RC0402.pdf; Author: CERN DEM JLC; CreateDate: 03/12/2007; LatestRevisionDate: 17/10/2012
T2 T5 = 2N7002BKS: 60V, 300mA Dual N-Channel Trench MOSFET; Manufacturer: NXP SEMICONDUCTORS; Manufacturer Part Number: 2N7002BKS6; PressFit: No; Bonding: No; Part Number: 2N7002BKS; Component Kind: Standard; Component Type: Standard; Device: 2N7002BKS; PackageDescription: SOT363, SC70-6, SOT, 0.65mm Pitch, 6 pin, 1.25mm W X 2.00mm L X 1.10mm H, IPC Medium Density; Part Description: 60 V, 300 mA Dual N-Channel Trench MOSFET; Pin Count: 4; Case: SOT363; Mounted: Yes; Socket: No; SMD: Yes; Sense: No; ComponentHeight: 1.1mm; HelpURL: \\cern.ch\dfs\Applications\Altium\Datasheets\2N7002BKS.pdf; Author: CERN DEM JLC; CreateDate: 2012-11-27; LatestRevisionDate: 2012-11-27